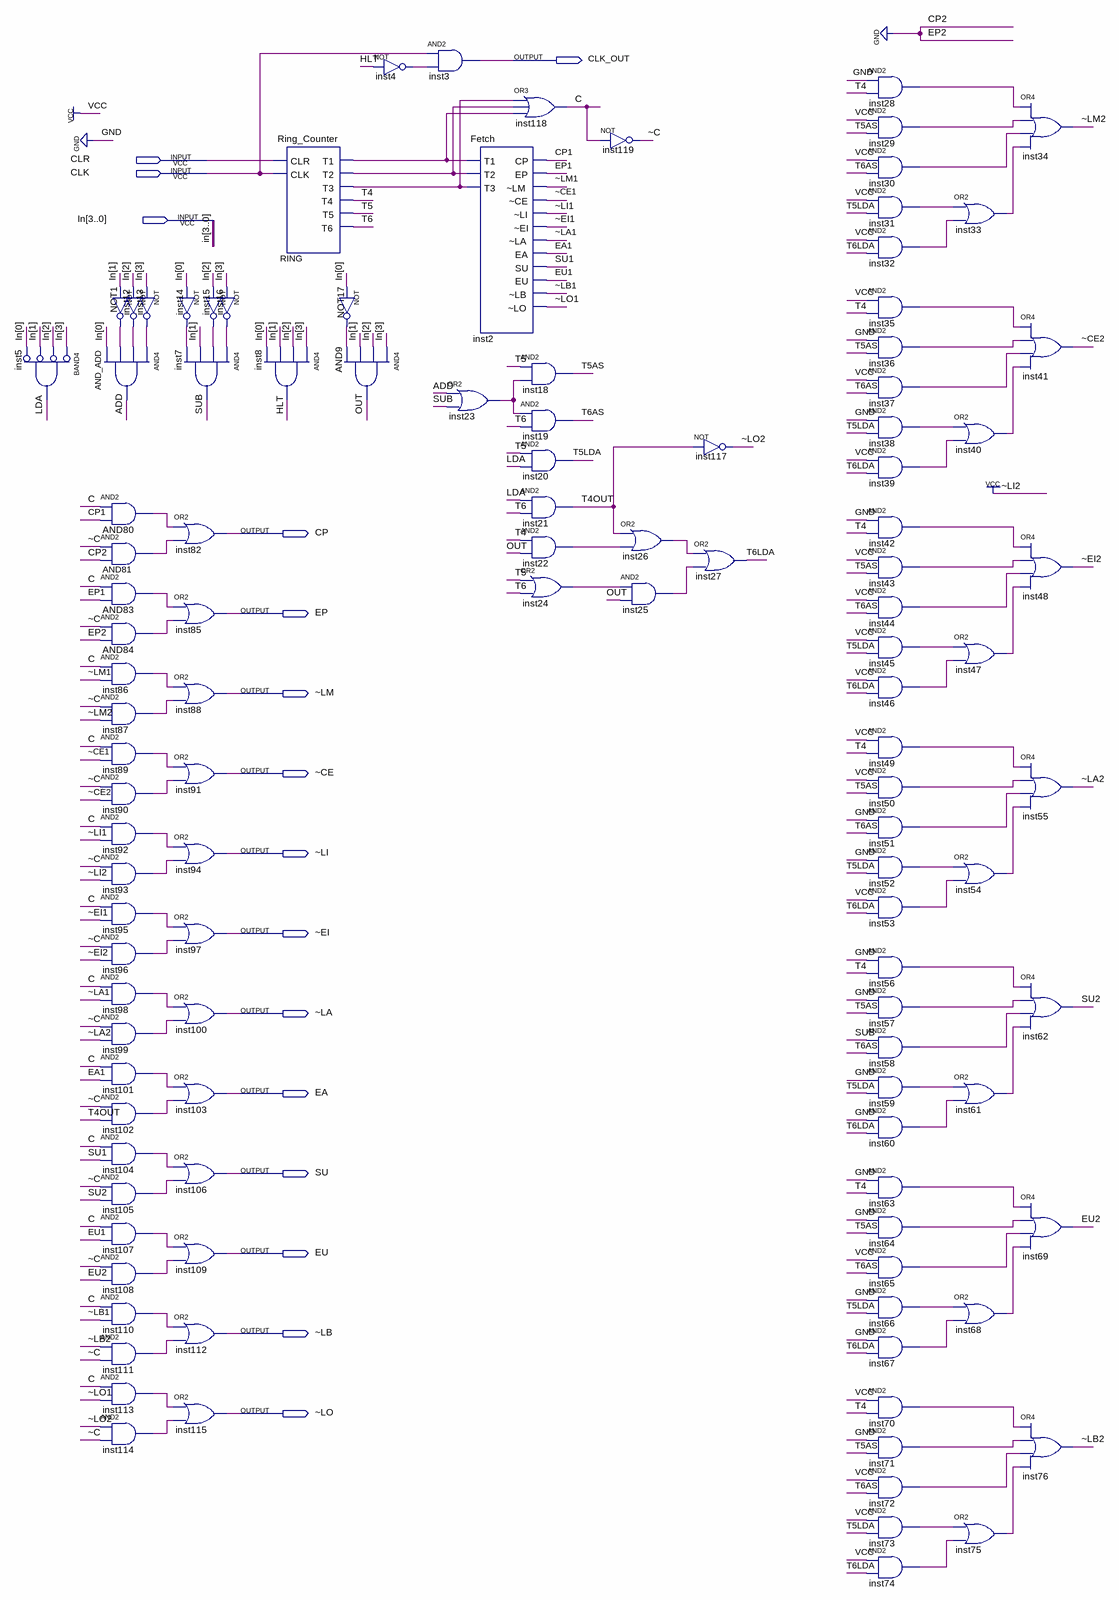
[diagram p0: schematic sheet]
// Quartus schematic Controlador_Sequencializador.bdf as structural Verilog: 114 symbols, 16 pins
module Controlador_Sequencializador (
  input  CLR,
  input  CLK,
  input  [3:0] In,
  output CLK_OUT,
  output CP,
  output EP,
  output \~LM ,
  output \~CE ,
  output \~LI ,
  output \~EI ,
  output \~LA ,
  output EA,
  output SU,
  output EU,
  output \~LB ,
  output \~LO 
);

  wire ADD, AND80_out, AND81_out, AND83_out, AND84_out, C, CP1, EA1, EP1, EU1, EU2, HLT, inst4_out,
       inst12_out, inst13_out, inst14_out, inst15_out, inst16_out, inst22_out, inst23_out, inst24_out,
       inst25_out, inst26_out, inst28_out, inst29_out, inst30_out, inst31_out, inst32_out, inst33_out,
       inst35_out, inst36_out, inst37_out, inst38_out, inst39_out, inst40_out, inst42_out, inst43_out,
       inst44_out, inst45_out, inst46_out, inst47_out, inst49_out, inst50_out, inst51_out, inst52_out,
       inst53_out, inst54_out, inst56_out, inst57_out, inst58_out, inst59_out, inst60_out, inst61_out,
       inst63_out, inst64_out, inst65_out, inst66_out, inst67_out, inst68_out, inst70_out, inst71_out,
       inst72_out, inst73_out, inst74_out, inst75_out, inst86_out, inst87_out, inst89_out, inst90_out,
       inst92_out, inst93_out, inst95_out, inst96_out, inst98_out, inst99_out, inst101_out, inst102_out,
       inst104_out, inst105_out, inst107_out, inst108_out, inst110_out, inst111_out, inst113_out,
       inst114_out, LDA, NOT1_out, NOT17_out, OUT, RING_t1, RING_t2, RING_t3, SU1, SU2, SUB, T4, T4OUT, T5,
       T5AS, T5LDA, T6, T6AS, T6LDA, \~C , \~CE1 , \~CE2 , \~EI1 , \~EI2 , \~LA1 , \~LA2 , \~LB1 , \~LB2 ,
       \~LI1 , \~LM1 , \~LM2 , \~LO1 , \~LO2 ;

  and inst5 (LDA, ~In[3], ~In[2], ~In[1], ~In[0]);  // BAND4
  not NOT1 (NOT1_out, In[1]);
  and AND_ADD (ADD, inst13_out, inst12_out, NOT1_out, In[0]);
  and AND80 (AND80_out, C, CP1);
  and AND81 (AND81_out, \~C , 1'b0);
  and AND83 (AND83_out, C, EP1);
  and AND84 (AND84_out, \~C , 1'b0);
  and inst86 (inst86_out, C, \~LM1 );
  and inst87 (inst87_out, \~C , \~LM2 );
  and inst89 (inst89_out, C, \~CE1 );
  and inst90 (inst90_out, \~C , \~CE2 );
  and inst92 (inst92_out, C, \~LI1 );
  and inst93 (inst93_out, \~C , 1'b1);
  and inst95 (inst95_out, C, \~EI1 );
  and inst96 (inst96_out, \~C , \~EI2 );
  and inst98 (inst98_out, C, \~LA1 );
  and inst99 (inst99_out, \~C , \~LA2 );
  and inst101 (inst101_out, C, EA1);
  and inst102 (inst102_out, \~C , T4OUT);
  and inst104 (inst104_out, C, SU1);
  and inst105 (inst105_out, \~C , SU2);
  and inst107 (inst107_out, C, EU1);
  and inst108 (inst108_out, \~C , EU2);
  and inst110 (inst110_out, C, \~LB1 );
  and inst111 (inst111_out, \~LB2 , \~C );
  and inst113 (inst113_out, C, \~LO1 );
  and inst114 (inst114_out, \~LO2 , \~C );
  not inst12 (inst12_out, In[2]);
  not inst13 (inst13_out, In[3]);
  not inst14 (inst14_out, In[0]);
  not inst15 (inst15_out, In[2]);
  not inst16 (inst16_out, In[3]);
  and inst7 (SUB, inst16_out, inst15_out, In[1], inst14_out);
  or inst82 (CP, AND80_out, AND81_out);
  or inst85 (EP, AND83_out, AND84_out);
  or inst88 (\~LM , inst86_out, inst87_out);
  or inst91 (\~CE , inst89_out, inst90_out);
  or inst94 (\~LI , inst92_out, inst93_out);
  or inst97 (\~EI , inst95_out, inst96_out);
  or inst100 (\~LA , inst98_out, inst99_out);
  or inst103 (EA, inst101_out, inst102_out);
  or inst106 (SU, inst104_out, inst105_out);
  or inst109 (EU, inst107_out, inst108_out);
  or inst112 (\~LB , inst110_out, inst111_out);
  or inst115 (\~LO , inst113_out, inst114_out);
  Ring_Counter RING (.CLR(CLR), .CLK(CLK), .T1(RING_t1), .T2(RING_t2), .T3(RING_t3), .T4(T4), .T5(T5), .T6(T6));
  and inst8 (HLT, In[3], In[2], In[1], In[0]);
  not inst4 (inst4_out, HLT);
  not NOT17 (NOT17_out, In[0]);
  and AND9 (OUT, In[3], In[2], In[1], NOT17_out);
  and inst3 (CLK_OUT, CLK, inst4_out);
  Fetch inst2 (
    .T1(RING_t1), .T2(RING_t2), .T3(RING_t3), .CP(CP1), .EP(EP1), .\~LM (\~LM1 ), .\~CE (\~CE1 ),
    .\~LI (\~LI1 ), .\~EI (\~EI1 ), .\~LA (\~LA1 ), .EA(EA1), .SU(SU1), .EU(EU1), .\~LB (\~LB1 ),
    .\~LO (\~LO1 ));
  or inst23 (inst23_out, ADD, SUB);
  or inst118 (C, RING_t3, RING_t2, RING_t1);
  and inst18 (T5AS, T5, inst23_out);
  and inst19 (T6AS, inst23_out, T6);
  and inst20 (T5LDA, T5, LDA);
  and inst21 (T4OUT, LDA, T6);
  and inst22 (inst22_out, T4, OUT);
  or inst24 (inst24_out, T5, T6);
  not inst119 (\~C , C);
  or inst26 (inst26_out, T4OUT, inst22_out);
  and inst25 (inst25_out, inst24_out, OUT);
  not inst117 (\~LO2 , T4OUT);
  or inst27 (T6LDA, inst26_out, inst25_out);
  and inst28 (inst28_out, 1'b0, T4);
  and inst29 (inst29_out, 1'b1, T5AS);
  and inst30 (inst30_out, 1'b1, T6AS);
  and inst31 (inst31_out, 1'b1, T5LDA);
  and inst32 (inst32_out, 1'b1, T6LDA);
  and inst35 (inst35_out, 1'b1, T4);
  and inst36 (inst36_out, 1'b0, T5AS);
  and inst37 (inst37_out, 1'b1, T6AS);
  and inst38 (inst38_out, 1'b0, T5LDA);
  and inst39 (inst39_out, 1'b1, T6LDA);
  and inst42 (inst42_out, 1'b0, T4);
  and inst43 (inst43_out, 1'b1, T5AS);
  and inst44 (inst44_out, 1'b1, T6AS);
  and inst45 (inst45_out, 1'b1, T5LDA);
  and inst46 (inst46_out, 1'b1, T6LDA);
  and inst49 (inst49_out, 1'b1, T4);
  and inst50 (inst50_out, 1'b1, T5AS);
  and inst51 (inst51_out, 1'b0, T6AS);
  and inst52 (inst52_out, 1'b0, T5LDA);
  and inst53 (inst53_out, 1'b1, T6LDA);
  and inst56 (inst56_out, 1'b0, T4);
  and inst57 (inst57_out, 1'b0, T5AS);
  and inst58 (inst58_out, SUB, T6AS);
  and inst59 (inst59_out, 1'b0, T5LDA);
  and inst60 (inst60_out, 1'b0, T6LDA);
  and inst63 (inst63_out, 1'b0, T4);
  and inst64 (inst64_out, 1'b0, T5AS);
  and inst65 (inst65_out, 1'b1, T6AS);
  and inst66 (inst66_out, 1'b0, T5LDA);
  and inst67 (inst67_out, 1'b0, T6LDA);
  and inst70 (inst70_out, 1'b1, T4);
  and inst71 (inst71_out, 1'b0, T5AS);
  and inst72 (inst72_out, 1'b1, T6AS);
  and inst73 (inst73_out, 1'b1, T5LDA);
  and inst74 (inst74_out, 1'b1, T6LDA);
  or inst33 (inst33_out, inst31_out, inst32_out);
  or inst40 (inst40_out, inst38_out, inst39_out);
  or inst47 (inst47_out, inst45_out, inst46_out);
  or inst54 (inst54_out, inst52_out, inst53_out);
  or inst61 (inst61_out, inst59_out, inst60_out);
  or inst68 (inst68_out, inst66_out, inst67_out);
  or inst75 (inst75_out, inst73_out, inst74_out);
  or inst34 (\~LM2 , inst28_out, inst29_out, inst30_out, inst33_out);
  or inst41 (\~CE2 , inst35_out, inst36_out, inst37_out, inst40_out);
  or inst48 (\~EI2 , inst42_out, inst43_out, inst44_out, inst47_out);
  or inst55 (\~LA2 , inst49_out, inst50_out, inst51_out, inst54_out);
  or inst62 (SU2, inst56_out, inst57_out, inst58_out, inst61_out);
  or inst69 (EU2, inst63_out, inst64_out, inst65_out, inst68_out);
  or inst76 (\~LB2 , inst70_out, inst71_out, inst72_out, inst75_out);
endmodule
